# Altium schematic sheet Sheet1.SchDoc
size B; SheetNumber: 2; SheetTotal: 3
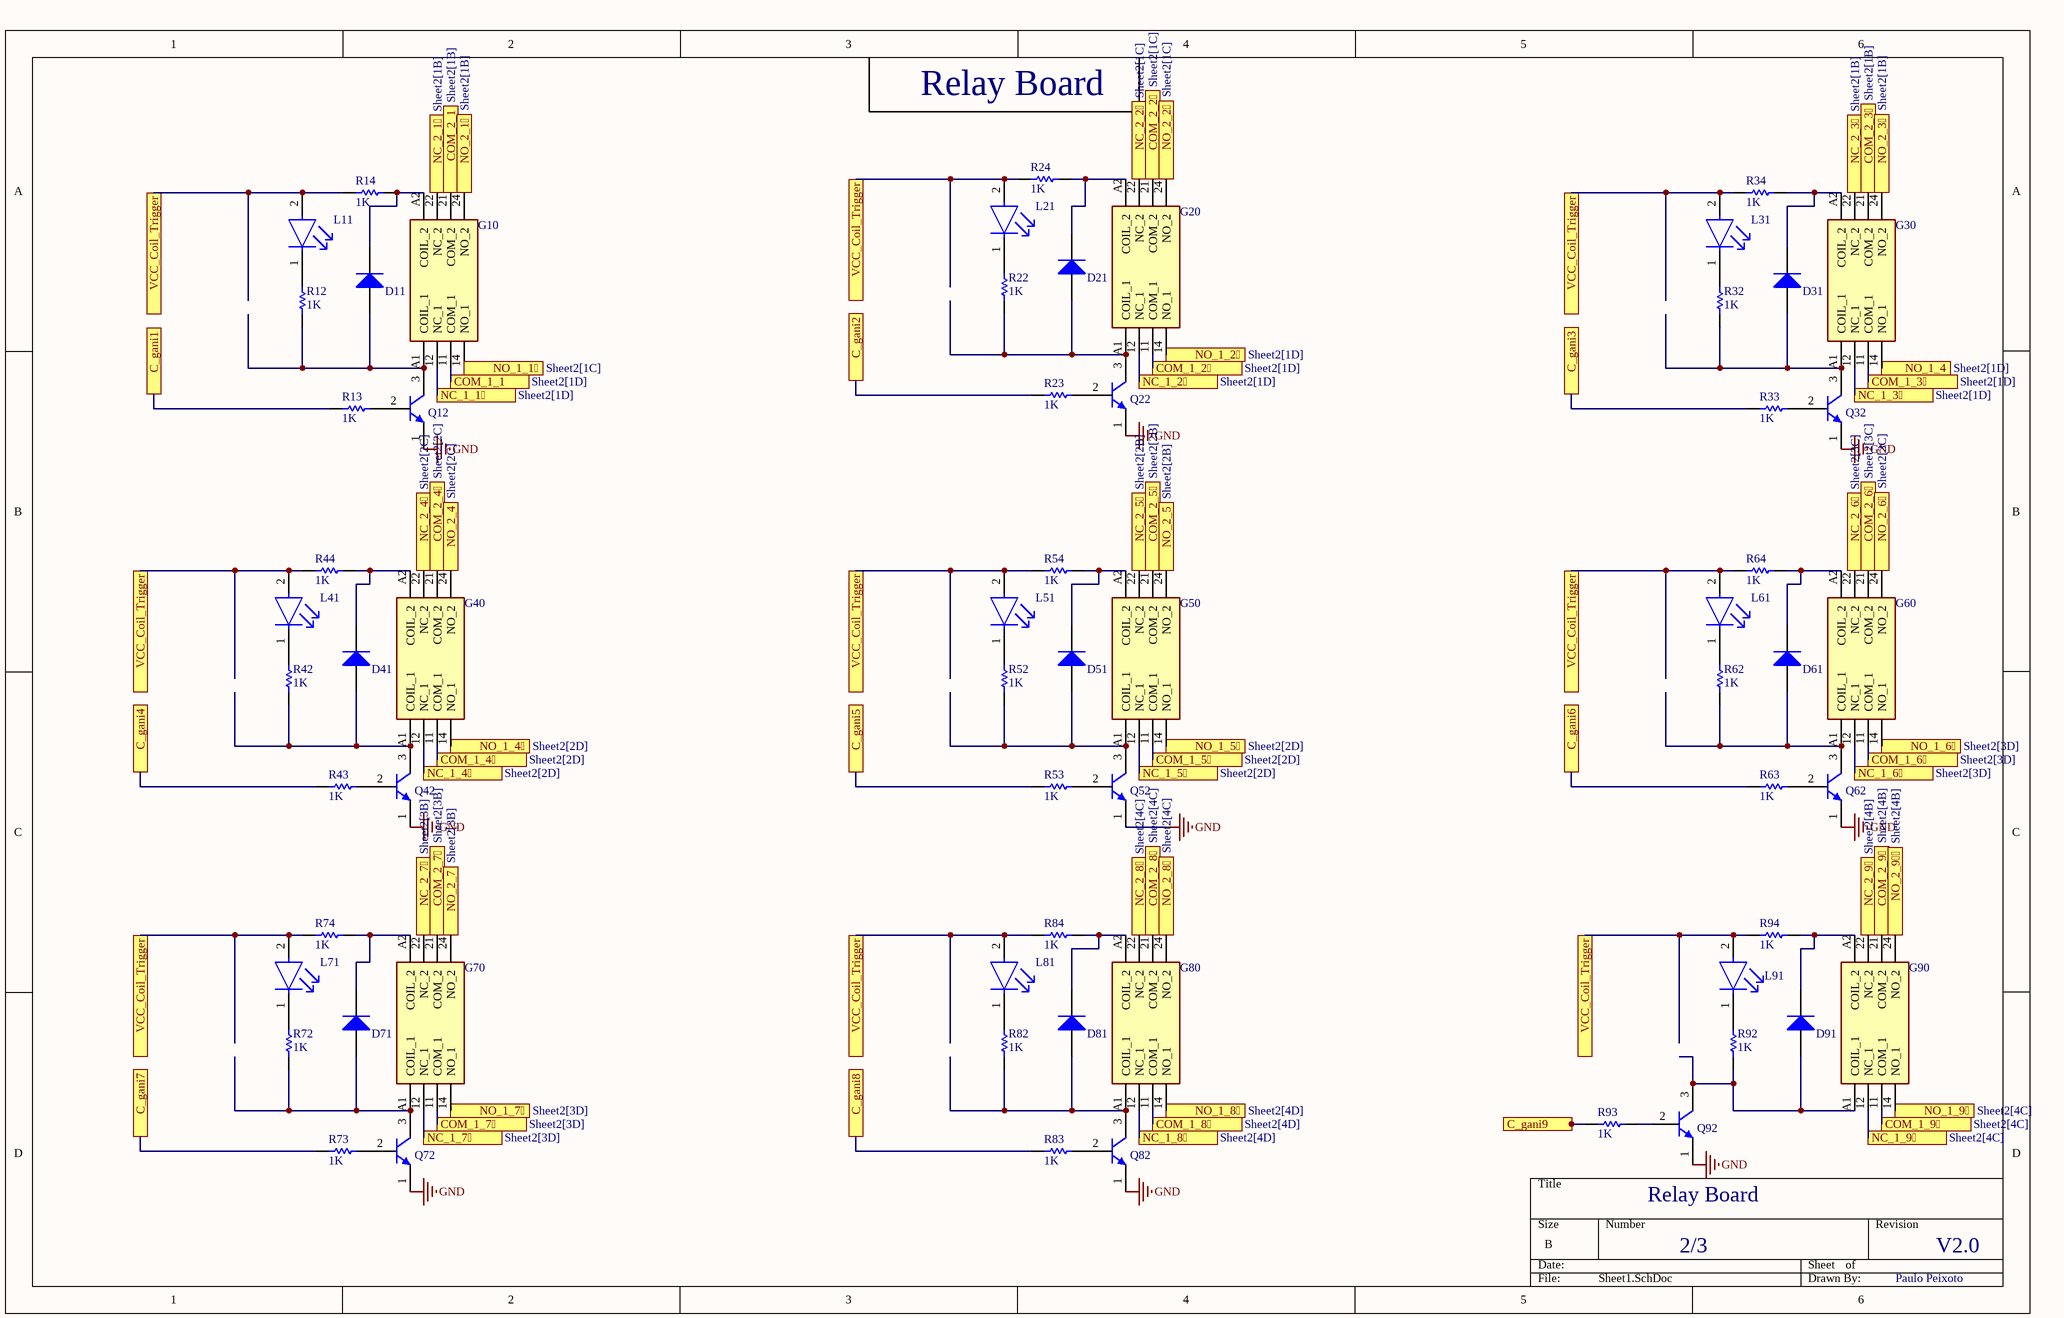
[diagram p0: Sheet1.SchDoc]

## Parts
D11  1N4001-T  [DIOD-DO-41-P-2_V]  (value not drawn)
D21  1N4001-T  [DIOD-DO-41-P-2_V]  (value not drawn)
D31  1N4001-T  [DIOD-DO-41-P-2_V]  (value not drawn)
D41  1N4001-T  [DIOD-DO-41-P-2_V]  (value not drawn)
D51  1N4001-T  [DIOD-DO-41-P-2_V]  (value not drawn)
D61  1N4001-T  [DIOD-DO-41-P-2_V]  (value not drawn)
D71  1N4001-T  [DIOD-DO-41-P-2_V]  (value not drawn)
D81  1N4001-T  [DIOD-DO-41-P-2_V]  (value not drawn)
D91  1N4001-T  [DIOD-DO-41-P-2_V]  (value not drawn)
G10  40.52.9.012.0000  [405290120000]  (value not drawn)
G20  40.52.9.012.0000  [405290120000]  (value not drawn)
G30  40.52.9.012.0000  [405290120000]  (value not drawn)
G40  40.52.9.012.0000  [405290120000]  (value not drawn)
G50  40.52.9.012.0000  [405290120000]  (value not drawn)
G60  40.52.9.012.0000  [405290120000]  (value not drawn)
G70  40.52.9.012.0000  [405290120000]  (value not drawn)
G80  40.52.9.012.0000  [405290120000]  (value not drawn)
G90  40.52.9.012.0000  [405290120000]  (value not drawn)
L11  TLLG4400  [FP-6_544-5255_01-4-MFG]  (value not drawn)
L21  TLLG4400  [FP-6_544-5255_01-4-MFG]  (value not drawn)
L31  TLLG4400  [FP-6_544-5255_01-4-MFG]  (value not drawn)
L41  TLLG4400  [FP-6_544-5255_01-4-MFG]  (value not drawn)
L51  TLLG4400  [FP-6_544-5255_01-4-MFG]  (value not drawn)
L61  TLLG4400  [FP-6_544-5255_01-4-MFG]  (value not drawn)
L71  TLLG4400  [FP-6_544-5255_01-4-MFG]  (value not drawn)
L81  TLLG4400  [FP-6_544-5255_01-4-MFG]  (value not drawn)
L91  TLLG4400  [FP-6_544-5255_01-4-MFG]  (value not drawn)
Q12  PN2222ATF  [FAIR-TO-92-3]  (value not drawn)
Q22  PN2222ATF  [FAIR-TO-92-3]  (value not drawn)
Q32  PN2222ATF  [FAIR-TO-92-3]  (value not drawn)
Q42  PN2222ATF  [FAIR-TO-92-3]  (value not drawn)
Q52  PN2222ATF  [FAIR-TO-92-3]  (value not drawn)
Q62  PN2222ATF  [FAIR-TO-92-3]  (value not drawn)
Q72  PN2222ATF  [FAIR-TO-92-3]  (value not drawn)
Q82  PN2222ATF  [FAIR-TO-92-3]  (value not drawn)
Q92  PN2222ATF  [FAIR-TO-92-3]  (value not drawn)
R12  1K  [RESC3216X70X50NL05T20]
R13  1K  [RESC3216X70X50NL05T20]
R14  1K  [RESC3216X70X50NL05T20]
R22  1K  [RESC3216X70X50NL05T20]
R23  1K  [RESC3216X70X50NL05T20]
R24  1K  [RESC3216X70X50NL05T20]
R32  1K  [RESC3216X70X50NL05T20]
R33  1K  [RESC3216X70X50NL05T20]
R34  1K  [RESC3216X70X50NL05T20]
R42  1K  [RESC3216X70X50NL05T20]
R43  1K  [RESC3216X70X50NL05T20]
R44  1K  [RESC3216X70X50NL05T20]
R52  1K  [RESC3216X70X50NL05T20]
R53  1K  [RESC3216X70X50NL05T20]
R54  1K  [RESC3216X70X50NL05T20]
R62  1K  [RESC3216X70X50NL05T20]
R63  1K  [RESC3216X70X50NL05T20]
R64  1K  [RESC3216X70X50NL05T20]
R72  1K  [RESC3216X70X50NL05T20]
R73  1K  [RESC3216X70X50NL05T20]
R74  1K  [RESC3216X70X50NL05T20]
R82  1K  [RESC3216X70X50NL05T20]
R83  1K  [RESC3216X70X50NL05T20]
R84  1K  [RESC3216X70X50NL05T20]
R92  1K  [RESC3216X70X50NL05T20]
R93  1K  [RESC3216X70X50NL05T20]
R94  1K  [RESC3216X70X50NL05T20]

## Ports
C_gani1 (see Sheet4[2C]), C_gani2 (see Sheet4[3C]), C_gani3 (see Sheet4[4C]), C_gani4 (see Sheet4[2C]), C_gani5 (see Sheet4[3C]), C_gani6 (see Sheet4[4C]), C_gani7 (see Sheet4[2D]), C_gani8 (see Sheet4[3D]), C_gani9 (see Sheet4[4D]), COM_1_1 (see Sheet2[1D]), COM_1_2 (see Sheet2[1D]), COM_1_3 (see Sheet2[1D]), COM_1_4 (see Sheet2[2D]), COM_1_5 (see Sheet2[2D]), COM_1_6 (see Sheet2[3D]), COM_1_7 (see Sheet2[3D]), COM_1_8 (see Sheet2[4D]), COM_1_9 (see Sheet2[4C]), COM_2_1 (see Sheet2[1B]), COM_2_2 (see Sheet2[1C]), COM_2_3 (see Sheet2[1B]), COM_2_4 (see Sheet2[2C]), COM_2_5 (see Sheet2[2B]), COM_2_6 (see Sheet2[3C]), COM_2_7 (see Sheet2[3B]), COM_2_8 (see Sheet2[4C]), COM_2_9 (see Sheet2[4B]), NC_1_1 (see Sheet2[1D]), NC_1_2 (see Sheet2[1D]), NC_1_3 (see Sheet2[1D]), NC_1_4 (see Sheet2[2D]), NC_1_5 (see Sheet2[2D]), NC_1_6 (see Sheet2[3D]), NC_1_7 (see Sheet2[3D]), NC_1_8 (see Sheet2[4D]), NC_1_9 (see Sheet2[4C]), NC_2_1 (see Sheet2[1B]), NC_2_2 (see Sheet2[1C]), NC_2_3 (see Sheet2[1B]), NC_2_4 (see Sheet2[2C]), NC_2_5 (see Sheet2[2B]), NC_2_6 (see Sheet2[3C]), NC_2_7 (see Sheet2[3B]), NC_2_8 (see Sheet2[4C]), NC_2_9 (see Sheet2[4B]), NO_1_1 (see Sheet2[1C]), NO_1_2 (see Sheet2[1D]), NO_1_4 (see Sheet2[2D]), NO_1_4 (see Sheet2[1D]), NO_1_5 (see Sheet2[2D]), NO_1_6 (see Sheet2[3D]), NO_1_7 (see Sheet2[3D]), NO_1_8 (see Sheet2[4D]), NO_1_9 (see Sheet2[4C]), NO_2_1 (see Sheet2[1B]), NO_2_2 (see Sheet2[1C]), NO_2_3 (see Sheet2[1B]), NO_2_4 (see Sheet2[2C]), NO_2_5 (see Sheet2[2B]), NO_2_6 (see Sheet2[3C]), NO_2_7 (see Sheet2[3B]), NO_2_8 (see Sheet2[4C]), NO_2_9 (see Sheet2[4B]), VCC_Coil_Trigger (see Sheet1[1A], Sheet1[1C], Sheet1[1D], Sheet1[3A], Sheet1[3C], Sheet1[3D], Sheet1[5A], Sheet1[5C], Sheet2[1A], Sheet2[2A], Sheet4[2B], Sheet4[2C], Sheet4[2D], Sheet4[3B], Sheet4[3C], Sheet4[3D], Sheet4[4B], Sheet4[4C], Sheet4[4D]), VCC_Coil_Trigger (see Sheet1[1A], Sheet1[1C], Sheet1[1D], Sheet1[3A], Sheet1[3C], Sheet1[3D], Sheet1[5A], Sheet1[5D], Sheet2[1A], Sheet2[2A], Sheet4[2B], Sheet4[2C], Sheet4[2D], Sheet4[3B], Sheet4[3C], Sheet4[3D], Sheet4[4B], Sheet4[4C], Sheet4[4D]), VCC_Coil_Trigger (see Sheet1[1A], Sheet1[1C], Sheet1[1D], Sheet1[3A], Sheet1[3C], Sheet1[3D], Sheet1[5C], Sheet1[5D], Sheet2[1A], Sheet2[2A], Sheet4[2B], Sheet4[2C], Sheet4[2D], Sheet4[3B], Sheet4[3C], Sheet4[3D], Sheet4[4B], Sheet4[4C], Sheet4[4D]), VCC_Coil_Trigger (see Sheet1[1A], Sheet1[1C], Sheet1[1D], Sheet1[3A], Sheet1[3C], Sheet1[5A], Sheet1[5C], Sheet1[5D], Sheet2[1A], Sheet2[2A], Sheet4[2B], Sheet4[2C], Sheet4[2D], Sheet4[3B], Sheet4[3C], Sheet4[3D], Sheet4[4B], Sheet4[4C], Sheet4[4D]), VCC_Coil_Trigger (see Sheet1[1A], Sheet1[1C], Sheet1[1D], Sheet1[3A], Sheet1[3D], Sheet1[5A], Sheet1[5C], Sheet1[5D], Sheet2[1A], Sheet2[2A], Sheet4[2B], Sheet4[2C], Sheet4[2D], Sheet4[3B], Sheet4[3C], Sheet4[3D], Sheet4[4B], Sheet4[4C], Sheet4[4D]), VCC_Coil_Trigger (see Sheet1[1A], Sheet1[1C], Sheet1[1D], Sheet1[3C], Sheet1[3D], Sheet1[5A], Sheet1[5C], Sheet1[5D], Sheet2[1A], Sheet2[2A], Sheet4[2B], Sheet4[2C], Sheet4[2D], Sheet4[3B], Sheet4[3C], Sheet4[3D], Sheet4[4B], Sheet4[4C], Sheet4[4D]), VCC_Coil_Trigger (see Sheet1[1A], Sheet1[1C], Sheet1[3A], Sheet1[3C], Sheet1[3D], Sheet1[5A], Sheet1[5C], Sheet1[5D], Sheet2[1A], Sheet2[2A], Sheet4[2B], Sheet4[2C], Sheet4[2D], Sheet4[3B], Sheet4[3C], Sheet4[3D], Sheet4[4B], Sheet4[4C], Sheet4[4D]), VCC_Coil_Trigger (see Sheet1[1A], Sheet1[1D], Sheet1[3A], Sheet1[3C], Sheet1[3D], Sheet1[5A], Sheet1[5C], Sheet1[5D], Sheet2[1A], Sheet2[2A], Sheet4[2B], Sheet4[2C], Sheet4[2D], Sheet4[3B], Sheet4[3C], Sheet4[3D], Sheet4[4B], Sheet4[4C], Sheet4[4D]), VCC_Coil_Trigger (see Sheet1[1C], Sheet1[1D], Sheet1[3A], Sheet1[3C], Sheet1[3D], Sheet1[5A], Sheet1[5C], Sheet1[5D], Sheet2[1A], Sheet2[2A], Sheet4[2B], Sheet4[2C], Sheet4[2D], Sheet4[3B], Sheet4[3C], Sheet4[3D], Sheet4[4B], Sheet4[4C], Sheet4[4D])

## Nets
GND: Q12.1(E) Q22.1(E) Q32.1(E) Q42.1(E) Q52.1(E) Q62.1(E) Q72.1(E) Q82.1(E) Q92.1(E)
C_gani1: R13.2 ; port C_gani1
C_gani2: R23.2 ; port C_gani2
C_gani3: R33.2 ; port C_gani3
C_gani4: R43.2 ; port C_gani4
C_gani5: R53.2 ; port C_gani5
C_gani6: R63.2 ; port C_gani6
C_gani7: R73.2 ; port C_gani7
C_gani8: R83.2 ; port C_gani8
C_gani9: R93.2 ; port C_gani9
COM_1_1: G10.11(COM_1) ; port COM_1_1
COM_1_2: G20.11(COM_1) ; port COM_1_2
COM_1_3: G30.11(COM_1) ; port COM_1_3
COM_1_4: G40.11(COM_1) ; port COM_1_4
COM_1_5: G50.11(COM_1) ; port COM_1_5
COM_1_6: G60.11(COM_1) ; port COM_1_6
COM_1_7: G70.11(COM_1) ; port COM_1_7
COM_1_8: G80.11(COM_1) ; port COM_1_8
COM_1_9: G90.11(COM_1) ; port COM_1_9
COM_2_1: G10.21(COM_2) ; port COM_2_1
COM_2_2: G20.21(COM_2) ; port COM_2_2
COM_2_3: G30.21(COM_2) ; port COM_2_3
COM_2_4: G40.21(COM_2) ; port COM_2_4
COM_2_5: G50.21(COM_2) ; port COM_2_5
COM_2_6: G60.21(COM_2) ; port COM_2_6
COM_2_7: G70.21(COM_2) ; port COM_2_7
COM_2_8: G80.21(COM_2) ; port COM_2_8
COM_2_9: G90.21(COM_2) ; port COM_2_9
NC_1_1: G10.12(NC_1) ; port NC_1_1
NC_1_2: G20.12(NC_1) ; port NC_1_2
NC_1_3: G30.12(NC_1) ; port NC_1_3
NC_1_4: G40.12(NC_1) ; port NC_1_4
NC_1_5: G50.12(NC_1) ; port NC_1_5
NC_1_6: G60.12(NC_1) ; port NC_1_6
NC_1_7: G70.12(NC_1) ; port NC_1_7
NC_1_8: G80.12(NC_1) ; port NC_1_8
NC_1_9: G90.12(NC_1) ; port NC_1_9
NC_2_1: G10.22(NC_2) ; port NC_2_1
NC_2_2: G20.22(NC_2) ; port NC_2_2
NC_2_3: G30.22(NC_2) ; port NC_2_3
NC_2_4: G40.22(NC_2) ; port NC_2_4
NC_2_5: G50.22(NC_2) ; port NC_2_5
NC_2_6: G60.22(NC_2) ; port NC_2_6
NC_2_7: G70.22(NC_2) ; port NC_2_7
NC_2_8: G80.22(NC_2) ; port NC_2_8
NC_2_9: G90.22(NC_2) ; port NC_2_9
NO_1_1: G10.14(NO_1) ; port NO_1_1
NO_1_2: G20.14(NO_1) ; port NO_1_2
NO_1_4: G30.14(NO_1) ; port NO_1_4
NO_1_4: G40.14(NO_1) ; port NO_1_4
NO_1_5: G50.14(NO_1) ; port NO_1_5
NO_1_6: G60.14(NO_1) ; port NO_1_6
NO_1_7: G70.14(NO_1) ; port NO_1_7
NO_1_8: G80.14(NO_1) ; port NO_1_8
NO_1_9: G90.14(NO_1) ; port NO_1_9
NO_2_1: G10.24(NO_2) ; port NO_2_1
NO_2_2: G20.24(NO_2) ; port NO_2_2
NO_2_3: G30.24(NO_2) ; port NO_2_3
NO_2_4: G40.24(NO_2) ; port NO_2_4
NO_2_5: G50.24(NO_2) ; port NO_2_5
NO_2_6: G60.24(NO_2) ; port NO_2_6
NO_2_7: G70.24(NO_2) ; port NO_2_7
NO_2_8: G80.24(NO_2) ; port NO_2_8
NO_2_9: G90.24(NO_2) ; port NO_2_9
VCC_Coil_Trigger: L11.2(A) L21.2(A) L31.2(A) L41.2(A) L51.2(A) L61.2(A) L71.2(A) L81.2(A) L91.2(A) R14.1 R24.1 R34.1 R44.1 R54.1 R64.1 R74.1 R84.1 R94.1 ; port VCC_Coil_Trigger
NetD11_1: D11.1(A) G10.A1(COIL_1) Q12.3(C) R12.1
NetD11_2: D11.2(K) G10.A2(COIL_2) R14.2
NetD21_1: D21.1(A) G20.A1(COIL_1) Q22.3(C) R22.1
NetD21_2: D21.2(K) G20.A2(COIL_2) R24.2
NetD31_1: D31.1(A) G30.A1(COIL_1) Q32.3(C) R32.1
NetD31_2: D31.2(K) G30.A2(COIL_2) R34.2
NetD41_1: D41.1(A) G40.A1(COIL_1) Q42.3(C) R42.1
NetD41_2: D41.2(K) G40.A2(COIL_2) R44.2
NetD51_1: D51.1(A) G50.A1(COIL_1) Q52.3(C) R52.1
NetD51_2: D51.2(K) G50.A2(COIL_2) R54.2
NetD61_1: D61.1(A) G60.A1(COIL_1) Q62.3(C) R62.1
NetD61_2: D61.2(K) G60.A2(COIL_2) R64.2
NetD71_1: D71.1(A) G70.A1(COIL_1) Q72.3(C) R72.1
NetD71_2: D71.2(K) G70.A2(COIL_2) R74.2
NetD81_1: D81.1(A) G80.A1(COIL_1) Q82.3(C) R82.1
NetD81_2: D81.2(K) G80.A2(COIL_2) R84.2
NetD91_1: D91.1(A) G90.A1(COIL_1) Q92.3(C) R92.1
NetD91_2: D91.2(K) G90.A2(COIL_2) R94.2
NetL11_1: L11.1(C) R12.2
NetL21_1: L21.1(C) R22.2
NetL31_1: L31.1(C) R32.2
NetL41_1: L41.1(C) R42.2
NetL51_1: L51.1(C) R52.2
NetL61_1: L61.1(C) R62.2
NetL71_1: L71.1(C) R72.2
NetL81_1: L81.1(C) R82.2
NetL91_1: L91.1(C) R92.2
NetQ12_2: Q12.2(B) R13.1
NetQ22_2: Q22.2(B) R23.1
NetQ32_2: Q32.2(B) R33.1
NetQ42_2: Q42.2(B) R43.1
NetQ52_2: Q52.2(B) R53.1
NetQ62_2: Q62.2(B) R63.1
NetQ72_2: Q72.2(B) R73.1
NetQ82_2: Q82.2(B) R83.1
NetQ92_2: Q92.2(B) R93.1

## Notes on the sheet
- Relay Board
- 2/3
- V2.0
- Paulo Peixoto

## Library data of the parts
D11 D21 D31 D41 D51 D61 D71 D81 D91 = CMP-0639-00006-2: 1.0 A Rectifier, 15 pF, 50 V, -65 to 150 degC, 2-Pin DO-41 Plastic, RoHS, Tape and Reel; Manufacturer: Diodes Inc; VF (V): 1; CT (pF): 15; Max. IR (uA): 5; VRRM (V): 50; Max. IFSM (A): 30; RoHS: TRUE; Mounting Technology: Through Hole; PartNumber: 1N4001-T; ComponentLink2Description: Datasheet; DatasheetVersion: Rev. 8-2; Operating Temperature Range (degC): -65 to 150; Packing: Tape and Reel; PackageReference: DO-41-P-2; ComponentLink1URL: http://diodes.com/; PackageDescription: 2-Pin Axial Lead, Body 4.635 x 2.36 mm, Lead Spread 25.4 mm; ComponentLink2URL: http://diodes.com/datasheets/ds28002.pdf; Max. Average Rectified Current IO (A): 1; ComponentLink1Description: Manufacturer URL
G10 G20 G30 G40 G50 G60 G70 G80 G90 = Relay 40.52.9.012.0000: Relay or Contactor; Manufacturer_Name: FINDER; Datasheet Link: http://uk.rs-online.com/web/p/products/1829776; Height: 25mm; Manufacturer_Part_Number: 40.52.9.012.0000
L11 L21 L31 L41 L51 L61 L71 L81 L91 = CMP-00030-55433990-1: TLLG4400 Led, Pcb, Green, 0.63MCD, 3MM, T-1, 7MA, 1.9V, 565NM, 25DEG, 20V, 20MW, -40; Lens Transparency: Diffused; Dominant Wavelength: 575nm; Test Current: 2mA; Viewing Angle: 50°; Lens Style: Circular, Colored, Diffused, Dome, Round; Number of LEDs: 1; Voltage Rating (DC): 2.4V; Luminous Intensity: 1.2mcd; Depth: 3.2mm; Wavelength: 575nm; Color: Green; Schedule B: 8541402000, 8541402000; RoHS: Compliant; Max Operating Temperature: 100°C; Power Dissipation: 20mW; Height: 4.5mm; Number of Pins: 2; Forward Voltage: 1.9V; NexarPartId: 55433990; Max Power Dissipation: 20mW; Length: 3.2mm; Forward Current: 2mA; Min Operating Temperature: -40°C; Illumination Color: Green; Lens Size: 3mm; Reverse Voltage: 20V; Mount: Through Hole; Case/Package: T; Radiation Hardening: No; Number of Elements: 1; REACH SVHC: Unknown; Lens Color: Green
Q12 Q22 Q32 Q42 Q52 Q62 Q72 Q82 Q92 = CMP-2000-06911-1: NPN General-Purpose Amplifier, 40 V, -55 to 150 degC, 3-Pin TO-92, RoHS, Tape and Reel; Manufacturer: FairchildSemiconductor; Configuration: Single; Collector-Emitter Saturation Voltage: 1V; Collector- Emitter Voltage VCEO Max: 40V; Unit Weight: 0.008466oz; Maximum DC Collector Current: 1A; DC Collector/Base Gain hfe Min: 100; Emitter- Base Voltage VEBO: 6V; Maximum Power Dissipation: 625mW; DC Current Gain hFE Max: 300; Gain Bandwidth Product fT: 300MHz; Collector- Base Voltage VCBO: 75V; Mounting Style: ThroughHole; Package Description: 3-Pin Transistor Outline Package, Body Dia 4.79 mm, Pitch 2.6 mm; Mounting Technology: ThroughHole; RoHS: Details; Brand: FairchildSemiconductor; Minimum Operating Temperature: -55C; Package / Case: TO-92-3KinkedLead; Package Reference: TO-92; Series: PN2222; Packaging: Reel; Datasheet Version: Rev. 1.1.0, 07/2014; Datasheet URL: https://www.fairchildsemi.com/datasheets/PN/PN2222A.pdf; Maximum Operating Temperature: +150C; Transistor Polarity: NPN; Factory Pack Quantity: 2000; Manufacturer URL: https://www.fairchildsemi.com/; <PCN>: http://www.mouser.com/PCN/3.26.10LTBDFairchild.pdf; Product Category: BipolarTransistors-BJT
R12-R14 R22-R24 R32-R34 R42-R44 R52-R54 R62-R64 R72-R74 R82-R84 R92-R94 = CMP-2003-00541-1: Manufacturer: Panasonic; Part Number: ERJ-8GEY0R00V